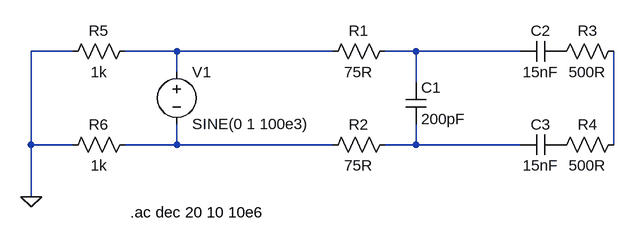
[diagram p0: schematic Draft2.asc]
Draft2.asc, the LTspice schematic file:
Version 4
SHEET 1 880 680
WIRE -224 144 -288 144
WIRE -64 144 -144 144
WIRE 176 144 -64 144
WIRE 304 144 256 144
WIRE 464 144 304 144
WIRE -64 176 -64 144
WIRE 304 192 304 144
WIRE -288 288 -288 144
WIRE -224 288 -288 288
WIRE -64 288 -64 256
WIRE -64 288 -144 288
WIRE 176 288 -64 288
WIRE 304 288 304 256
WIRE 304 288 256 288
WIRE 464 288 304 288
WIRE 608 288 608 144
WIRE -288 368 -288 288
FLAG -288 368 0
SYMBOL res 272 128 R90
WINDOW 0 0 56 VBottom 2
WINDOW 3 32 56 VTop 2
SYMATTR InstName R1
SYMATTR Value 75R
SYMBOL res 272 272 R90
WINDOW 0 0 56 VBottom 2
WINDOW 3 32 56 VTop 2
SYMATTR InstName R2
SYMATTR Value 75R
SYMBOL res 624 128 R90
WINDOW 0 0 56 VBottom 2
WINDOW 3 32 56 VTop 2
SYMATTR InstName R3
SYMATTR Value 500R
SYMBOL res 624 272 R90
WINDOW 0 0 56 VBottom 2
WINDOW 3 32 56 VTop 2
SYMATTR InstName R4
SYMATTR Value 500R
SYMBOL cap 288 192 R0
SYMATTR InstName C1
SYMATTR Value 200pF
SYMBOL cap 528 128 R90
WINDOW 0 0 32 VBottom 2
WINDOW 3 32 32 VTop 2
SYMATTR InstName C2
SYMATTR Value 15nF
SYMBOL cap 528 272 R90
WINDOW 0 0 32 VBottom 2
WINDOW 3 32 32 VTop 2
SYMATTR InstName C3
SYMATTR Value 15nF
SYMBOL voltage -64 160 R0
WINDOW 123 0 0 Left 0
WINDOW 39 0 0 Left 0
SYMATTR InstName V1
SYMATTR Value SINE(0 1 100e3)
SYMBOL res -128 128 R90
WINDOW 0 0 56 VBottom 2
WINDOW 3 32 56 VTop 2
SYMATTR InstName R5
SYMATTR Value 1k
SYMBOL res -128 272 R90
WINDOW 0 0 56 VBottom 2
WINDOW 3 32 56 VTop 2
SYMATTR InstName R6
SYMATTR Value 1k
TEXT -136 392 Left 2 !.ac dec 20 10 10e6

The netlist it stands for:
* Draft2.asc
R1 N002 N001 75R
R2 N004 N003 75R
R3 N005 P001 500R
R4 N005 P002 500R
C1 N002 N004 200pF
C2 P001 N002 15nF
C3 P002 N004 15nF
V1 N001 N003 SINE(0 1 100e3)
R5 N001 0 1k
R6 N003 0 1k
.ac dec 20 10 10e6
.backanno
.end